# Altium schematic sheet Guitar Input Schematic.SchDoc
size A; SheetNumber: 1; SheetTotal: 1
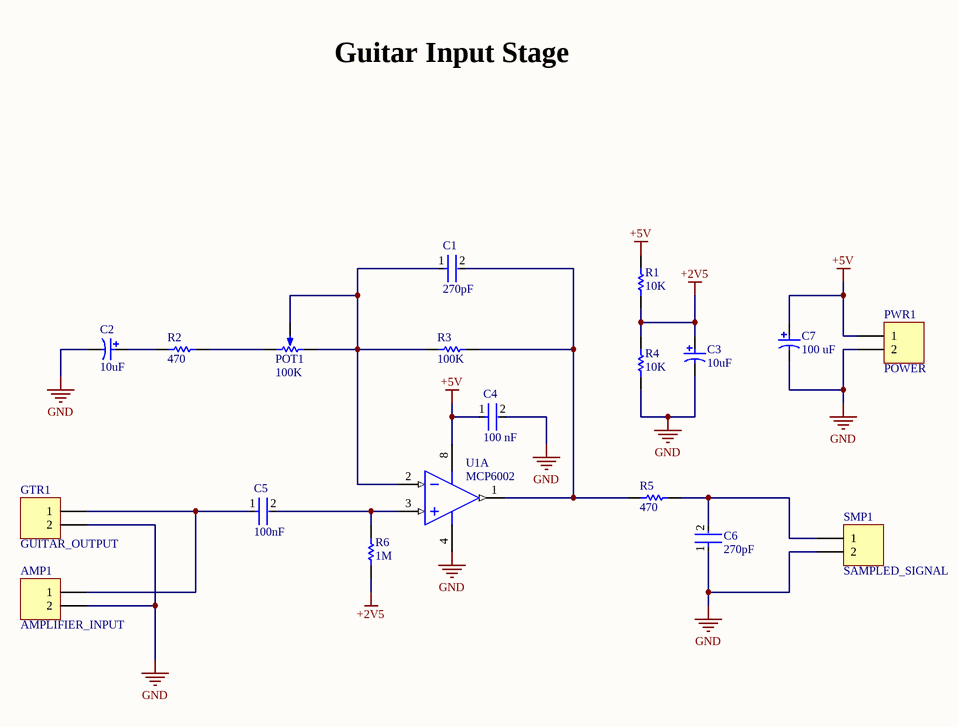
[diagram p0: Guitar Input Schematic.SchDoc]

## Parts
AMP1  AMPLIFIER_INPUT  [HDR1X2]
C1  270pF  [FP-C0805C-DN-MFG]
C2  10uF  [KEMT-A-3216-18-2_M]
C3  10uF  [KEMT-A-3216-18-2_M]
C4  100 nF  [FP-C0805C-DN-MFG]
C5  100nF  [FP-C0805C-DN-MFG]
C6  270pF  [FP-C0805C-DN-MFG]
C7  100 uF  [KEMT-T491-D_L]
GTR1  GUITAR_OUTPUT  [HDR1X2]
POT1  100K  [BOUR-3362P]
PWR1  POWER  [HDR1X2]
R1  10K  [RESC2013X60X35NL10T20]
R2  470  [RESC2013X70X40ML20T20]
R3  100K  [RESC2013X60X35ML10T20]
R4  10K  [RESC2013X60X35NL10T20]
R5  470  [RESC2013X70X40ML20T20]
R6  1M  [RESC2013X70X40NL20T20]
SMP1  SAMPLED_SIGNAL  [HDR1X2]
U1  MCP6002  [SOIC-SN8_M]  (part A of 2)

## Nets
+2V5: C3.1 R1.1 R4.2 R6.1
+5V: C4.1 C7.1 PWR1.1 R1.2 U1.8(VDD)
GND: AMP1.2 C2.2 C3.2 C4.2 C6.1 C7.2 GTR1.2 PWR1.2 R4.1 SMP1.2 U1.4(VSS)
NetAMP1_1: AMP1.1 C5.1 GTR1.1
NetC1_1: C1.1 POT1.1(CCW) POT1.2(S) R3.1 U1.2(VINA-)
NetC1_2: C1.2 R3.2 R5.1 U1.1(VOUTA)
NetC2_1: C2.1 R2.1
NetC5_2: C5.2 R6.2 U1.3(VINA+)
NetC6_2: C6.2 R5.2 SMP1.1
NetPOT1_3: POT1.3(CW) R2.2

## Notes on the sheet
- Guitar Input Stage

## Library data of the parts
AMP1 GTR1 PWR1 SMP1 = Header 2: Header, 2-Pin; LatestRevisionDate: 17-Jul-2002; LatestRevisionNote: Re-released for DXP Platform.; Publisher: Altium Limited
C1 C6 = CMP-1036-02406-3: CAP CER 270PF 50V C0G/NP0 0805; Manufacturer: KEMET; Manufacturer Part Number: C0805C271J5GACTU; Material: Ceramic; Temperature Characteristic: C0G; Temperature Coefficient: 30ppm/°C; Description: C0805 270 pF C0G 30ppm/°C 5.00% 50 V; Tolerance: 0.05; Device Class L3: Ceramic Capacitors; Lead Free: Yes; Ipc Land Pattern Name: CAPC200125X78; Digikey Description: CAP CER 270PF 50V C0G/NP0 0805; Device Class L1: Passive Components; Temperature: -55°C to +125°C; ComponentLink2Description: Datasheet; Voltage Rating: 50 V; Temperature Range High: +125°C; Height: 0.88mm; Capacitance: 270 pF; Mouser Description: Multilayer Ceramic Capacitors MLCC - SMD/SMT 50volts 270pF C0G 5%; Value: 270 pF; ComponentLink2URL: https://content.kemet.com/datasheets/KEM_C1003_C0G_SMD.pdf; RoHS: TRUE; Temperature Range Low: -55°C; Device Class L2: Capacitors; Automotive: No; Octopart: https://octopart.com/c0805c271j5gactu-kemet-104903; Category: Cap; Package: C0805C-DN
C2 C3 = CMP-2000-05172-1: Capacitor, Tantalum, 10 uF, +/- 10%, 10 V, -55 to 125 degC, 2-Pin SMD (1206), RoHS, Tape and Reel; Manufacturer Size Code: A; Manufacturer: Kemet; Type: Molded; Online Catalog: T491Series; Other Names: 399-3684-2; Voltage - Rated: 10V; Lifetime @ Temp.: 2000Hrs@85degC; Product Training Modules: CapacitorBasics-TypicalUsesforCapacitorsDeratingGuidelinesforSurfaceMountTantalumCapacitors; ESR (Equivalent Series Resistance): 3.8Ohm; Capacitance: 10µF; Catalog Drawings: T49x,T5xxSeries_A-side1T49x,T5xxSeries_A,B-side2T49x,T5xxSeries_A,SBottom; Family: TantalumCapacitors; Manufacturer URL: http://www.kemet.com/; Datasheet URL: http://www.farnell.com/datasheets/1824869.pdf; Package Reference: 1206; Packaging: Tape&Reel(TR); Series: T491; Operating Temperature: -55degC~125degC; Mounting Type: SurfaceMount; Height - Seated (Max): 0.071"(1.80mm); Package / Case: 1206(3216Metric); Package Description: 2-Pin Surface Mount Device, Body 3.2 x 1.6 mm; Features: GeneralPurpose; Tolerance: ±10%; Lead Spacing: -; Size / Dimension: 0.126"Lx0.063"W(3.20mmx1.60mm); Standard Package: 2,000; Datasheet Version: Apr-14; Category: Capacitors
C4 C5 = CMP-2007-00279-2: CAP CER 0.1UF 50V X7R 0805; Manufacturer Part Number: C0805C104K5RACTU; Manufacturer: KEMET; Value: 0.10 μF; Description: C0805 0.10 μF X7R 30ppm/°C 10.00% 50 V; Tolerance: 0.1; Temperature Coefficient: 30ppm/°C; Material: Ceramic; Device Class L2: Capacitors; Temperature Range Low: -55°C; Voltage Rating: 50 V; Digikey Description: CAP CER 0.1UF 50V X7R 0805; Category: Cap; ComponentLink2Description: Datasheet; Octopart: https://octopart.com/c0805c104k5ractu-kemet-143926; RoHS: TRUE; ComponentLink2URL: https://content.kemet.com/datasheets/KEM_C1003_C0G_SMD.pdf; Temperature Characteristic: X7R; Temperature: -55°C to +125°C; Height: 0.88mm; Temperature Range High: +125°C; Device Class L1: Passive Components; Automotive: No; Lead Free: Yes; Ipc Land Pattern Name: CAPC200125X78; Device Class L3: Ceramic Capacitors; Mouser Description: Cap Ceramic 0.1uF 50V X7R 10% SMD 2.0 x 1.2 mm 125 C Paper T/R; Capacitance: 0.10 μF; Package: C0805C-DN
C7 = CMP-2000-07541-1: Tantalum Surface Mount Capacitor, 100 uF, +/- 10%, 16 V, -55 to 125 degC, 2917 (7343 Metric), RoHS, Tape and Reel; Manufacturer: Kemet; ESR (Equivalent Series Resistance): 700mOhm; Dissipation Factor: 8%; Voltage Rating (DC): 16V; Case\/Package: Molded; Polarity: Polar; Capacitance: 100uF; Life (Hours): 2000Hour; Leakage Current: 16uA; Ripple Current: 463mA; RoHSCompliant: true; Datasheet Version: 07/2017; Case Code (Imperial): 2917; Width: 4.3mm; Height: 2.8mm; Min Operating Temperature: -55degC; Length: 7.3mm; Package Reference: T491-D; Dielectric Material: Tantalum; Packaging: TapeandReel; Max Operating Temperature: 125degC; Package Description: 2-Pin Surface Mount Device, Body 7.3 x 4.3 mm; Package Quantity: 1; Lead Free: LeadFree; Case Code (Metric): 7343; Voltage: 16V; Voltage Rating: 16V; Tolerance: 10%; Weight: 0.023634oz; Termination: SMD/SMT; Lead Pitch: 3.6mm; Manufacturer URL: http://www.kemet.com/; Datasheet URL: http://www.kemet.com/Lists/ProductCatalog/Attachments/254/KEM_T2005_T491.pdf; Radiation Hardening: No; Mount: PCB; Height - Seated (Max): 0.122inch; Mounting Technology: SurfaceMount; Depth: 4.3mm; REACH SVHC: NoSVHC
POT1 = CMP-1747-00003-1: Square Trimpot(R) Trimming Potentiometer, 100 KOhm, 300 V, -55 to 125 degC, 3-Pin THD, RoHS, Tube; Voltage Rating: 250 V; Case\Package: Axial; Tolerance: 1%; Power Rating: 250 mW; Resistance: 1 mohm; RoHSCompliant: true; ComponentLink2URL: http://www.bourns.com/docs/Product-Datasheets/3362.pdf; ComponentLink1Description: Manufacturer URL; DatasheetVersion: May-16; Package Quantity: 200; ComponentLink2Description: Datasheet; Min Operating Temperature: -55 degC; Mount: Through Hole; PackageDescription: 3-Pin Through Hole Device, Body 6.6 x 6.99 mm, Pitch 2.54 mm; Length: 0.248 inch; ComponentLink1URL: http://www.bourns.com/; PackageReference: 3326P; Max Operating Temperature: 155 degC; Packaging: Bulk
R1 R4 = CMP-1659-00013-4: Chip Resistor, 10 KOhm, +/- 1%, 0.125 W, -55 to 155 degC, 0805 (2012 Metric), RoHS, Tape and Reel; Manufacturer: Yageo; Voltage Rating: 150 V; Mount: Surface Mount; ComponentLink1Description: Manufacturer URL; ComponentLink2URL: http://www.yageo.com/documents/recent/PYu-RC_Group_51_RoHS_L_04.pdf; Pins: 2; Length: 2 mm; Min Operating Temperature: -55 degC; Height: 0.5 mm; Mounting Technology: Surface Mount; RoHSCompliant: true; REACH SVHC: No SVHC; ComponentLink1URL: http://www.yageo.com/; Max Operating Temperature: 155 degC; PackageReference: 0805; DatasheetVersion: Rev. 4, 02/2016; Package Quantity: 5000; Packaging: Tape and Reel; ComponentLink2Description: Datasheet; PackageDescription: 2-Pin Surface Mounted Device, Body 2 x 1.25 mm
R2 R5 = CMP-2001-00549-5: Chip Resistor, 470 Ohm, +/- 1%, 0.125 W, -55 to 155 degC, 0805 (2012 Metric), RoHS, Tape and Reel; Manufacturer: Panasonic; Voltage Rating: 150 V; ComponentLink1URL: http://www.panasonic.com/; ComponentLink2Description: Datasheet; RoHSCompliant: true; PackageDescription: 2-Pin Surface Mount Device, Body 2 x 1.25 mm; PackageReference: 0805; REACH SVHC: Yes; Max Operating Temperature: 155 degC; Mount: Surface Mount; Min Operating Temperature: -55 degC; DatasheetVersion: 04/2015; Mounting Technology: Surface Mount; Height: 0.6 mm; Package Quantity: 1; ComponentLink2URL: http://industrial.panasonic.com/cdbs/www-data/pdf/RDA0000/AOA0000C86.pdf; Length: 2 mm; ComponentLink1Description: Manufacturer URL; Pins: 2; Packaging: Cut Tape
R3 = CMP-2100-03668-1: Chip Resistor, 100 KOhm, +/- 1%, 0.125 W, -55 to 155 degC, 0805 (2012 Metric), RoHS, Tape and Reel; Manufacturer: Yageo; Max Power Dissipation: 125mW; Voltage Rating: 150V; Temperature Coefficient: 100ppm/degreesC; Manufacturer URL: http://www.yageo.com/; Min Operating Temperature: -55degC; Lead Pitch: 0.4mm; Composition: ThickFilm; Case Code (Metric): 2012; Military Standard: Not; Package Description: 2-Pin Surface Mounted Device, Body 2 x 1.25 mm; REACH SVHC: Unknown; RoHSCompliant: true; Depth: 1.25mm; Number of Pins: 2; Lead Free: LeadFree; Resistance: 100KOhm; Datasheet URL: http://www.yageo.com/NewPortal/yageodocoutput?fileName=/pdf/R-Chip/PYu-RC_Group_51_RoHS_L_5.pdf; Max Operating Temperature: 155degC; Case/Package: 0805; Package Quantity: 1; Case Code (Imperial): 0805; Power Rating: 125mW; Width: 0.049inch; Package Reference: 0805; Height: 0.024inch; Termination: SMD/SMT; Tolerance: 1%; Datasheet Version: Rev. 5, 10/2016; Length: 2mm; Voltage Rating (DC): 150V; Number of Terminations: 2; Packaging: TapeandReel
R6 = CMP-2001-04378-5: Chip Resistor, 1000 KOhm, +/- 1%, 0.125 W, -55 to 155 degC, 0805 (2012 Metric), RoHS, Tape and Reel; Manufacturer: Panasonic; Voltage Rating: 150 V; ComponentLink2URL: http://industrial.panasonic.com/cdbs/www-data/pdf/RDA0000/AOA0000C86.pdf; PackageReference: 0805; Min Operating Temperature: -55 degC; RoHSCompliant: true; Package Quantity: 5000; ComponentLink1URL: http://www.panasonic.com/; Pins: 2; Height: 0.6 mm; Packaging: Tape and Reel; ComponentLink2Description: Datasheet; ComponentLink1Description: Manufacturer URL; Mounting Technology: Surface Mount; REACH SVHC: Yes; Mount: Surface Mount; PackageDescription: 2-Pin Surface Mount Device, Body 2 x 1.25 mm; DatasheetVersion: 04/2015; Max Operating Temperature: 155 degC; Length: 2 mm
U1 = CMP-0187-00368-2: 1 MHz, Low-Power Operational Amplifier, 8-Pin SOIC, Extended Temperature; ComponentLink1URL: http://www.microchip.com/; ComponentLink2URL: http://ww1.microchip.com/downloads/en/DeviceDoc/21733j.pdf; ComponentLink3URL: http://www.microchip.com/stellent/groups/techpub_sg/documents/packagingspec/en012702.pdf; Code_JEDEC: MS-012; PackageVersion: revBB, Aug-2009; ComponentLink2Description: Datasheet; PackageDescription: 8-Lead Plastic Small Outline (SN) - Narrow, 3.90mm Body [SOIC]; PackageReference: SOIC-SN8; ComponentLink1Description: Manufacturer URL; RevisionNote: URLs added.; Code_IPC: SOIC127P600-8; ComponentLink3Description: Package Specification; DatasheetVersion: revJ, Nov-2009